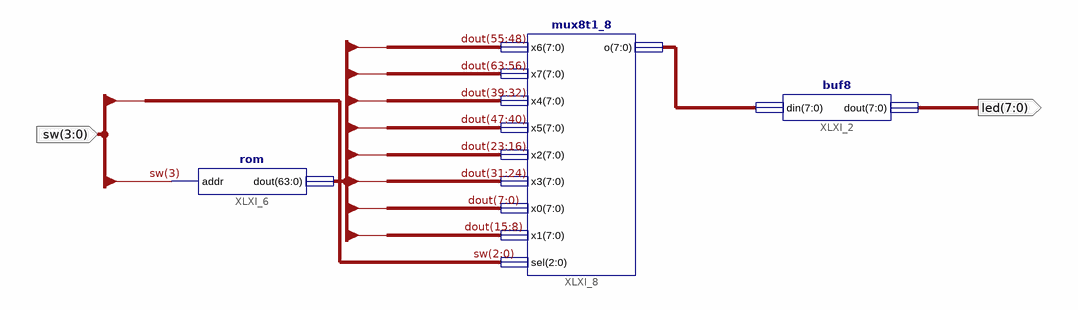
[diagram p0: schematic sheet 1]
// Xilinx ISE schematic top_mux.sch (kintex7) as structural Verilog: 3 symbols, 2 ports
module top_mux (
  input  [3:0] sw,
  output [7:0] led
);

  wire [7:0] XLXN_48;
  wire [63:0] dout;

  buf8 XLXI_2 (.din(XLXN_48), .dout(led));
  rom XLXI_6 (.addr(sw[3]), .dout(dout));
  mux8t1_8 XLXI_8 (
    .x6(dout[55:48]), .x7(dout[63:56]), .x4(dout[39:32]), .x5(dout[47:40]), .x2(dout[23:16]),
    .x3(dout[31:24]), .x0(dout[7:0]), .x1(dout[15:8]), .sel(sw[2:0]), .o(XLXN_48));
endmodule
